# EAGLE design Qwiic Solid State Relay (EAGLE 9.6.0)
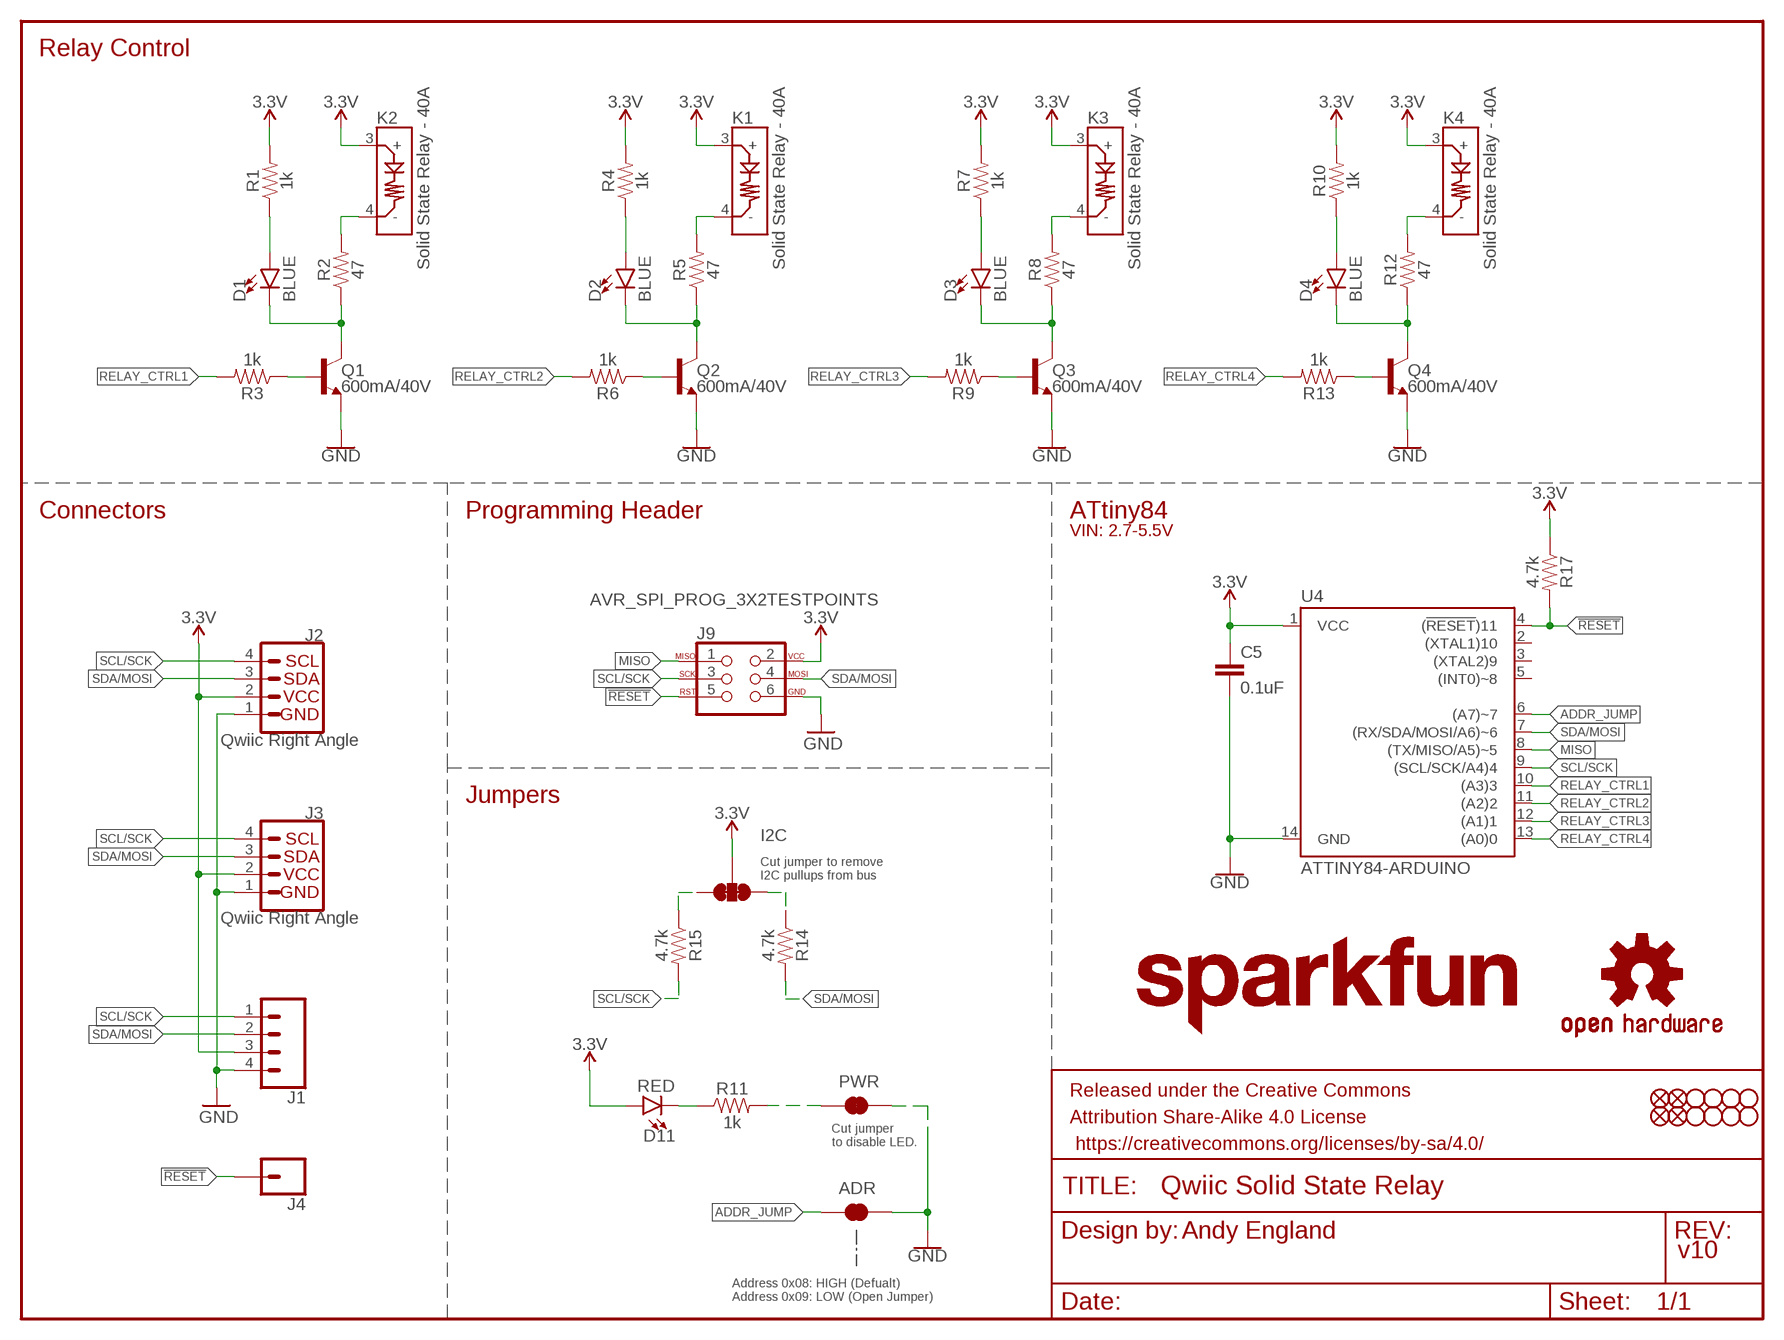
[diagram p0: schematic, sheet 1]

## Parts
ADR  JUMPER-SMT_2_NC_TRACE_SILK  [SMT-JUMPER_2_NC_TRACE_SILK]
C5  0.1uF  0.1UF-0603-25V-(+80/-20%)  [0603]
D1  BLUE  LED-BLUE0603  [LED-0603]
D2  BLUE  LED-BLUE0603  [LED-0603]
D3  BLUE  LED-BLUE0603  [LED-0603]
D4  BLUE  LED-BLUE0603  [LED-0603]
D11  RED  LED-RED0603  [LED-0603]
FD1  FIDUCIAL1X2  [FIDUCIAL-1X2]
FD2  FIDUCIAL1X2  [FIDUCIAL-1X2]
FD3  FIDUCIAL1X2  [FIDUCIAL-1X2]
FD4  FIDUCIAL1X2  [FIDUCIAL-1X2]
FRAME1  FRAME-LETTER  [CREATIVE_COMMONS]
I2C  JUMPER-SMT_3_2-NC_TRACE_SILK  [SMT-JUMPER_3_2-NC_TRACE_SILK]
J1  CONN_041X04_NO_SILK  [1X04_NO_SILK]
J2  Qwiic Right Angle  I2C_STANDARDQWIIC  [JST04_1MM_RA]
J3  Qwiic Right Angle  I2C_STANDARDQWIIC  [JST04_1MM_RA]
J4  CONN_01PTH_NO_SILK_YES_STOP  [1X01_NO_SILK]
J9  AVR_SPI_PROG_3X2TESTPOINTS  [2X3_TEST_POINTS]
JP1  STAND-OFF  [STAND-OFF]
JP2  STAND-OFF  [STAND-OFF]
JP3  STAND-OFF  [STAND-OFF]
JP4  STAND-OFF  [STAND-OFF]
JP5  STAND-OFF  [STAND-OFF]
JP6  STAND-OFF  [STAND-OFF]
JP7  STAND-OFF  [STAND-OFF]
JP8  STAND-OFF  [STAND-OFF]
K1  Solid State Relay - 40A  SOLID_STATE_RELAY_SSR-40DA-H  [SSR-40DA-H]
K2  Solid State Relay - 40A  SOLID_STATE_RELAY_SSR-40DA-H  [SSR-40DA-H]
K3  Solid State Relay - 40A  SOLID_STATE_RELAY_SSR-40DA-H  [SSR-40DA-H]
K4  Solid State Relay - 40A  SOLID_STATE_RELAY_SSR-40DA-H  [SSR-40DA-H]
LOGO1  SFE_LOGO_NAME1_INCH  [SFE_LOGO_NAME_1]
LOGO2  OSHW-LOGOS  [OSHW-LOGO-S]
PWR  JUMPER-SMT_2_NC_TRACE_SILK  [SMT-JUMPER_2_NC_TRACE_SILK]
Q1  600mA/40V  TRANS_NPN-MMBT2222AL  [SOT23-3]
Q2  600mA/40V  TRANS_NPN-MMBT2222AL  [SOT23-3]
Q3  600mA/40V  TRANS_NPN-MMBT2222AL  [SOT23-3]
Q4  600mA/40V  TRANS_NPN-MMBT2222AL  [SOT23-3]
R1  1k  1KOHM-0603-1/10W-1%  [0603]
R2  47  47OHM-0603-1/10W-1%  [0603]
R3  1k  1KOHM-0603-1/10W-1%  [0603]
R4  1k  1KOHM-0603-1/10W-1%  [0603]
R5  47  47OHM-0603-1/10W-1%  [0603]
R6  1k  1KOHM-0603-1/10W-1%  [0603]
R7  1k  1KOHM-0603-1/10W-1%  [0603]
R8  47  47OHM-0603-1/10W-1%  [0603]
R9  1k  1KOHM-0603-1/10W-1%  [0603]
R10  1k  1KOHM-0603-1/10W-1%  [0603]
R11  1k  1KOHM-0603-1/10W-1%  [0603]
R12  47  47OHM-0603-1/10W-1%  [0603]
R13  1k  1KOHM-0603-1/10W-1%  [0603]
R14  4.7k  4.7KOHM-0603-1/10W-1%  [0603]
R15  4.7k  4.7KOHM-0603-1/10W-1%  [0603]
R17  4.7k  4.7KOHM-0603-1/10W-1%  [0603]
U4  ATTINY84-ARDUINO  [SO14]

## Nets
3.3V: C5.1 D11.A I2C.2 J1.3 J2.2 J3.2 J9.2 K1.3(+) K2.3(+) K3.3(+) K4.3(+) R1.2 R4.2 R7.2 R10.2 R17.1 U4.1(VCC)
!RESET: J4.1 J9.5 R17.2 U4.4((!RESET!)11)
ADDR_JUMP: ADR.1 U4.6((A7)~7)
GND: ADR.2 C5.2 J1.4 J2.1 J3.1 J9.6 PWR.1 Q1.2(E) Q2.2(E) Q3.2(E) Q4.2(E) U4.14(GND)
MISO: J9.1 U4.8((TX/MISO/A5)~5)
N$1: D2.C Q2.3(C) R5.1
N$2: D1.C Q1.3(C) R2.1
N$3: K1.4(-) R5.2
N$4: D2.A R4.1
N$5: D3.C Q3.3(C) R8.1
N$6: K3.4(-) R8.2
N$7: D1.A R1.1
N$8: D3.A R7.1
N$9: D4.C Q4.3(C) R12.1
N$10: K2.4(-) R2.2
N$11: K4.4(-) R12.2
N$12: D4.A R10.1
N$13: D11.C R11.1
N$14: PWR.2 R11.2
N$15: I2C.3 R15.1
N$16: I2C.1 R14.1
OPTO_1: Q1.1(B) R3.1
OPTO_2: Q2.1(B) R6.1
OPTO_3: Q3.1(B) R9.1
OPTO_4: Q4.1(B) R13.1
RELAY_CTRL1: R3.2 U4.10((A3)3)
RELAY_CTRL2: R6.2 U4.11((A2)2)
RELAY_CTRL3: R9.2 U4.12((A1)1)
RELAY_CTRL4: R13.2 U4.13((A0)0)
SCL/SCK: J1.1 J2.4 J3.4 J9.3 R15.2 U4.9((SCL/SCK/A4)4)
SDA/MOSI: J1.2 J2.3 J3.3 J9.4 R14.2 U4.7((RX/SDA/MOSI/A6)~6)
Unconnected: U4.2((XTAL1)10) U4.3((XTAL2)9) U4.5((INT0)~8)

## Notes on the sheet
- Relay Control
- Connectors | Programming Header | ATtiny84
- VIN: 2.7-5.5V
- Jumpers
- Cut jumper to remove 
  I2C pullups from bus
- Cut jumper 
  to disable LED.
- Andy England
- v10
- Address 0x08: HIGH (Defualt)
  Address 0x09: LOW (Open Jumper)

## Library data of the parts
ADR PWR = SparkFun-Jumpers:JUMPER-SMT_2_NC_TRACE: Normally closed trace jumper This jumper has a trace between two pads so it's normally closed (NC). Use a razor knife to open the connection. For best results follow the IPC guidelines for cutting traces: Cutout at least 0.063 mm (0.005 in). Remove all loose material to clean up the cut area. Seal the cut with an approved epoxy. Reapply solder to reclose the connection.
C5 = SparkFun-Capacitors:0.1UF: 0.1µF ceramic capacitors A capacitor is a passive two-terminal electrical component used to store electrical energy temporarily in an electric field.; PROD_ID: CAP-00810
D1-D4 = SparkFun-LED:LED-BLUE: Blue SMD LED Used in manufacturing of various products at SparkFun Packages: 0603 - SMD 0603 package [Product Link] <http://www.digikey.com/product-detail/en/SMLE12BC7TT86/511-1589-2-ND/1641808> 1206 - SMD1206 package [Product Link] <http://www.digikey.com/product-detail/en/lite-on-inc/LTST-C150TBKT/160-1643-1-ND/573584> SparkFun Products: ESP8266 Thing-Dev Board <https://www.sparkfun.com/products/13711> RedBoard <https://www.sparkfun.com/products/12757>; PROD_ID: DIO-08575
D11 = SparkFun-LED:LED-RED: Red SMD LED Used in manufacturing of most products at SparkFun Packages: 0603 - SMD 0603 package [Product Link] <http://docs.avagotech.com/docs/AV02-0551EN> 0603 SMART - SMD 0603 SMART package ( more efficient and expensive)[Product Link] <http://www.osram-os.com/Graphics/XPic2/00077099_0.pdf> 1206 - SMD1206 package [Product Link] <https://www.sparkfun.com/datasheets/DevTools/LilyPad/Q150OVS4.pdff> SparkFun Products: Pro Mini 328 -5V <https://www.sparkfun.com/products/821> RedBoard <https://www.sparkfun.com/products/12757> IOIO-OTG <https://www.sparkfun.com/products/13613>; PROD_ID: DIO-00819
FD1-FD4 = SparkFun-Aesthetics:FIDUCIAL: Fiducial Alignment Points Point-of-reference for pick-and-place machines and other optical instruments.
FRAME1 = SparkFun-Aesthetics:FRAME-LETTER: Schematic Frame - Letter Standard 8.5x11 US Letter frame
I2C = SparkFun-Jumpers:JUMPER-SMT_3_2-NC_TRACE: Normally closed trace jumper (2 of 2 connections) This jumper has a trace between all three pads so they are normally closed (NC). Use a razor knife to open the connection(s). For best results follow the IPC guidelines for cutting traces: Cutout at least 0.063 mm (0.005 in). Remove all loose material to clean up the cut area. Seal the cut with an approved epoxy. Reapply solder to reclose the connection(s).
J1 = SparkFun-Connectors:CONN_04: Multi connection point. Often used as Generic Header-pin footprint for 0.1 inch spaced/style header connections On any of the 0.1 inch spaced packages, you can populate with these: Break Away Headers - Straight <https://www.sparkfun.com/products/116> (PRT-00116) Break Away Male Headers - Right Angle <https://www.sparkfun.com/products/553> (PRT-00553) Female Headers <https://www.sparkfun.com/products/115> (PRT-00115) Break Away Headers - Machine Pin <https://www.sparkfun.com/products/117> (PRT-00117) Break Away Female Headers - Swiss Machine Pin <https://www.sparkfun.com/products/743> (PRT-00743) For SCREWTERMINALS and SPRING TERMINALS visit here: Screw Terimnals on SparkFun.com <https://www.sparkfun.com/search/results?term=Screw+Terminals> (5mm/3.5mm/2.54mm spacing) This device is also useful as a general connection point to wire up your design to another part of your project. Our various solder wires solder well into these plated through hole pads. Hook-Up Wire - Assortment (Stranded, 22 AWG) <https://www.sparkfun.com/products/11375> (PRT-11375) Hook-Up Wire - Assortment (Solid Core, 22 AWG) <https://www.sparkfun.com/products/11367> (PRT-11367) View the entire wire category on our website here <https://www.sparkfun.com/categories/141> Special notes: Molex polarized connector foot print use with SKU : PRT-08231 with associated crimp pins and housings. 1MM SMD Version SKU: PRT-10208; PROD_ID: CONN-09696
J2 J3 = SparkFun-Connectors:I2C_STANDARD: SparkFun I2C Standard Pinout Header SparkFun has standardized on a pinout for all I2C based sensor breakouts. This pinout allows I2C boards to be plugged directly into the headers on Arduino Uno compatible boards, and to be daisy chained easily. Example SparkFun Products: SparkFun Atmospheric Sensor Breakout - BME280 <https://www.sparkfun.com/products/13676> SparkFun Altitude/Pressure Sensor Breakout - MPL3115A2 <https://www.sparkfun.com/products/11084> SparkFun TOF Range Finder Sensor - VL6180 <https://www.sparkfun.com/products/12785>; PROD_ID: CONN-13694
J4 = SparkFun-Connectors:CONN_01: Single connection point. Often used as Generic Header-pin footprint for 0.1 inch spaced/style header connections On any of the 0.1 inch spaced packages, you can populate with these: Break Away Headers - Straight <https://www.sparkfun.com/products/116> (PRT-00116) Break Away Male Headers - Right Angle <https://www.sparkfun.com/products/553> (PRT-00553) Female Headers <https://www.sparkfun.com/products/115> (PRT-00115) Break Away Headers - Machine Pin <https://www.sparkfun.com/products/117> (PRT-00117) Break Away Female Headers - Swiss Machine Pin <https://www.sparkfun.com/products/743> (PRT-00743) This device is also useful as a general connection point to wire up your design to another part of your project. Our various solder wires solder well into these plated through hole pads. Hook-Up Wire - Assortment (Stranded, 22 AWG) <https://www.sparkfun.com/products/11375> (PRT-11375) Hook-Up Wire - Assortment (Solid Core, 22 AWG) <https://www.sparkfun.com/products/11367> (PRT-11367) View the entire wire category on our website here <https://www.sparkfun.com/categories/141> Special notes: SMTSO-256-ET is a "flush mount" nut for a 4-40 screw. We mostly use this on specialty testbeds; it is a nice way to connect hardware to your PCB at an adjustable hieght. Also note, the SNAP packages are for using a snappable style connector. We sell a baggie of snaps and they are also used on two LilyPad designs: Snap Assortment - 30 pack (male and female) <https://www.sparkfun.com/products/11347> (DEV-11347) LilyPad Arduino SimpleSnap <https://www.sparkfun.com/products/10941> (DEV-10941) LilyPad SimpleSnap Protoboard <https://www.sparkfun.com/products/10940> (DEV-10940)
J9 = SparkFun-Connectors:AVR_SPI_PROG_3X2: AVR ISP 6 Pin This is the reduced ISP connector for AVR programming. Common on Arduino. This footprint will take up less PCB space and can be used with a 10-pin to 6-pin adapter such as SKU: BOB-08508 **Special note about "TEST_POINT" package. The stop mask is on the top side, so if you want your programming test points to be on the bottom of your board, make sure to place this package on the bottom side of the board. This also ensure that the orientation to program from the bottom side will be correct. SparkFun Products: SparkFun ISP Pogo Adapter <https://www.sparkfun.com/products/11591> - NS Tiny AVR Programmer <https://www.sparkfun.com/products/11801> -PTH
JP1-JP8 = SparkFun-Hardware:STAND-OFF: Stand Off Drill holes for mechanically mounting via screws, standoffs, etc. Note: Use the keepout ring to avoid running the screw head into surrounding components. Variant Overviews STAND-OFF - Mechanical footprint for a #4 phillips button head screw. STAND-OFF-TIGHT - Mechanical footprint for a #4 phillips button head screw, Example SparkFun Products Screw - Phillips Head (1/4", 4-40, 10 pack) <https://www.sparkfun.com/products/10453> (PRT-10453) Screw - Phillips Head (1/2", 4-40, 10 pack) <https://www.sparkfun.com/products/10452> (PRT-10452) Screw - Phillips Head (3/4", 4-40, 10 pack) <https://www.sparkfun.com/products/10451> (PRT-10451) Screw - Phillips Head (1", 4-40, 10 pack) <https://www.sparkfun.com/products/10450> (PRT-10450)
K1-K4 = SparkFun-DiscreteSemi:SOLID_STATE_RELAY_SSR-40DA-H: Fotek SSR-40DA-H DC->AC Solid State Relay This particular SSR can switch current loads of up to 40A with a 3-32V DC input and a zero cross trigger control method. Each one of these relays is equipped with four screw terminals (for use with ring or fork connectors) and a plastic cover that slides over the top of the relay to protect the terminals.; PROD_ID: COMP-15116, CONN-08399, 2 x HW-15038
LOGO1 = SparkFun-Aesthetics:SFE_LOGO_NAME: SparkFun Font Logo This is the SparkFun name logo. The logo on the schematic will always be the same size; the package variant is the height of the flame part of the logo (or the height the flame would be, if it were drawn). Default layer for the logo on the board is tSilk.
LOGO2 = SparkFun-Aesthetics:OSHW-LOGO: Open-Source Hardware (OSHW) Logo This logo indicates the piece of hardware it is found on incorporates a OSHW license and/or adheres to the definition of open source hardware found here: http://freedomdefined.org/OSHW
Q1-Q4 = SparkFun-DiscreteSemi:TRANS_NPN: NPN transistor Current controlled devices typically used to amplify current or used as a switch. BC547 - COM-08928 <http://www.sparkfun.com/products/8928> (TO-92 45V 100mA) (1.Collector 2.Base 3.Emitter) 2N3904 - COM-00521 <http://www.sparkfun.com/products/521> (TO-92 40V 200mA) (1.Emitter 2.Base 3.Collector) P2N2222A - COM-12852 <http://www.sparkfun.com/products/12852> (TO-92 40V 600mA) (1.Collector 2.Base 3.Emitter); PROD_ID: TRANS-08049
R1 R3 R4 R6 R7 R9-R11 R13 = SparkFun-Resistors:1KOHM: 1kΩ resistor A resistor is a passive two-terminal electrical component that implements electrical resistance as a circuit element. Resistors act to reduce current flow, and, at the same time, act to lower voltage levels within circuits. - Wikipedia; PROD_ID: RES-07856
R2 R5 R8 R12 = SparkFun-Resistors:47OHM: 47Ω resistor A resistor is a passive two-terminal electrical component that implements electrical resistance as a circuit element. Resistors act to reduce current flow, and, at the same time, act to lower voltage levels within circuits. - Wikipedia; PROD_ID: RES-14282
R14 R15 R17 = SparkFun-Resistors:4.7KOHM: 4.7kΩ resistor A resistor is a passive two-terminal electrical component that implements electrical resistance as a circuit element. Resistors act to reduce current flow, and, at the same time, act to lower voltage levels within circuits. - Wikipedia; PROD_ID: RES-07857
U4 = SparkFun-IC-Microcontroller:ATTINY84-ARDUINO; PROD_ID: IC-14155

## Board
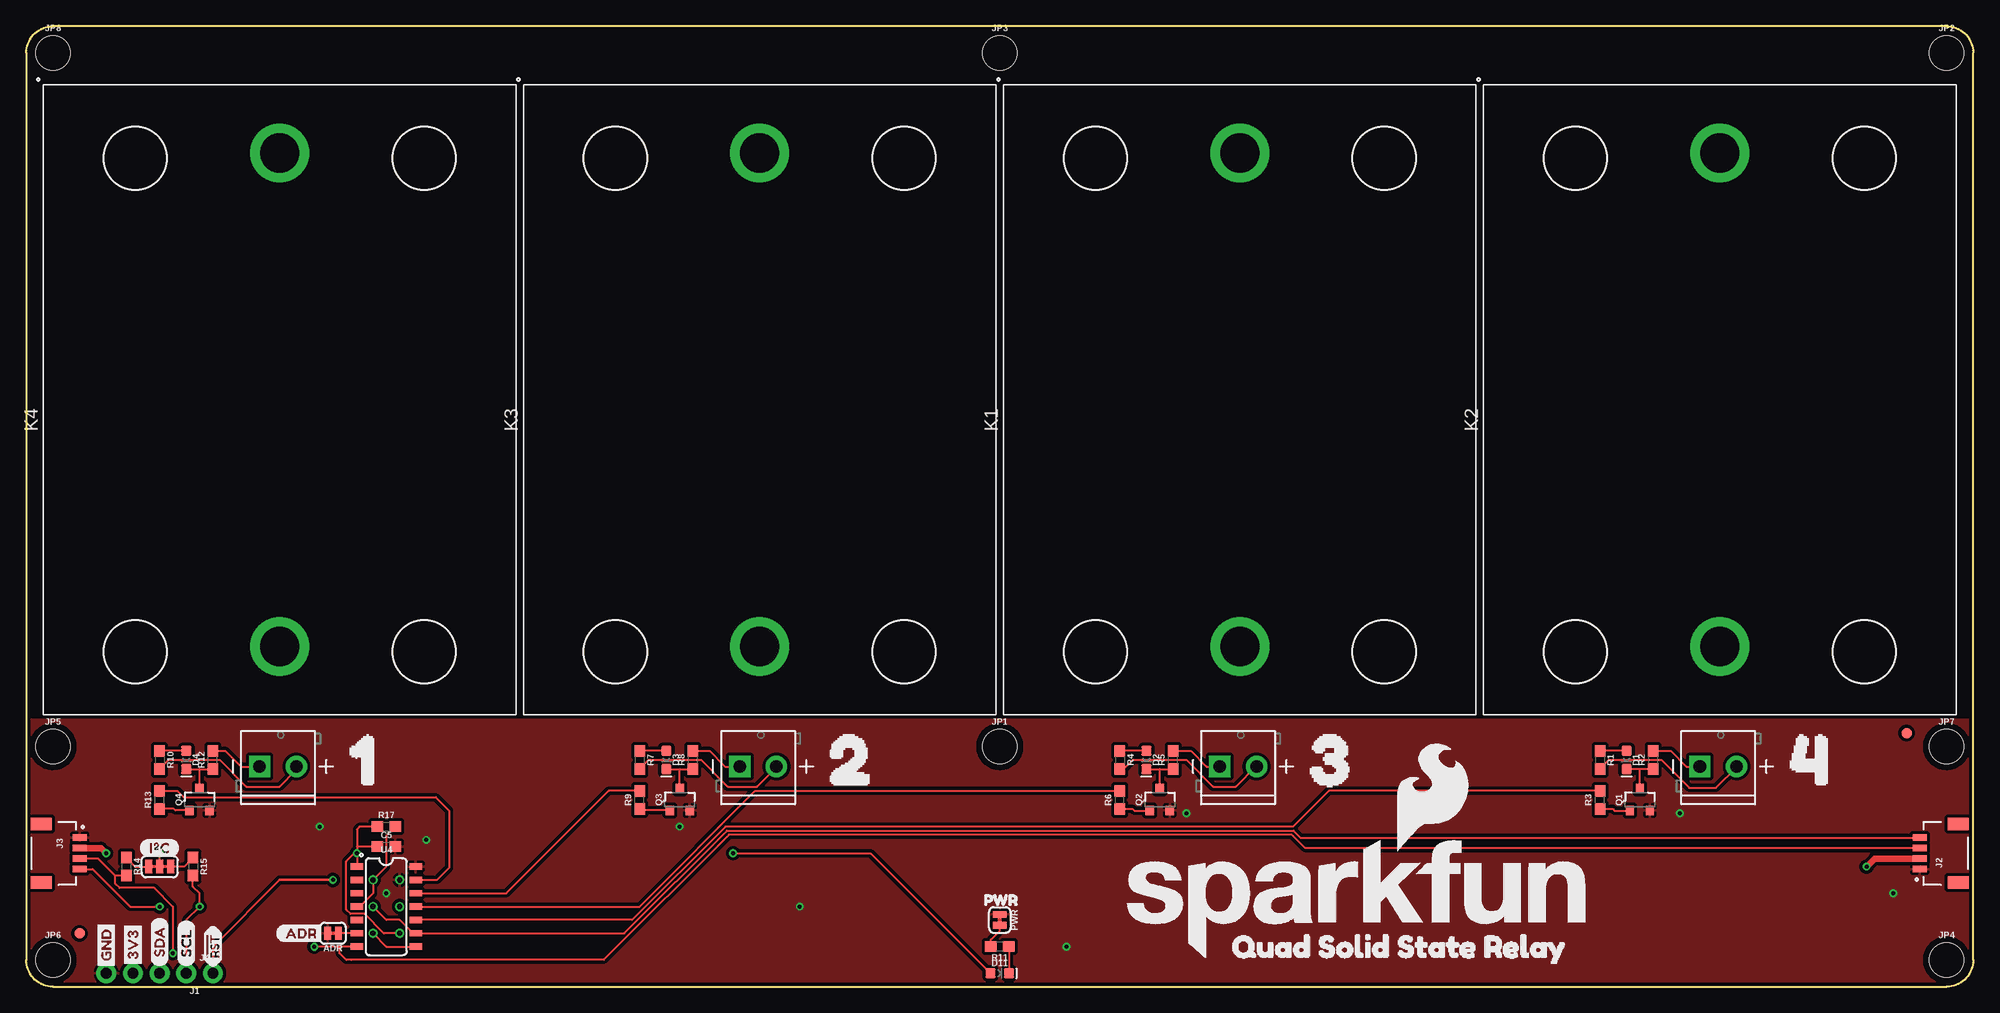
[diagram p1: board, top side]
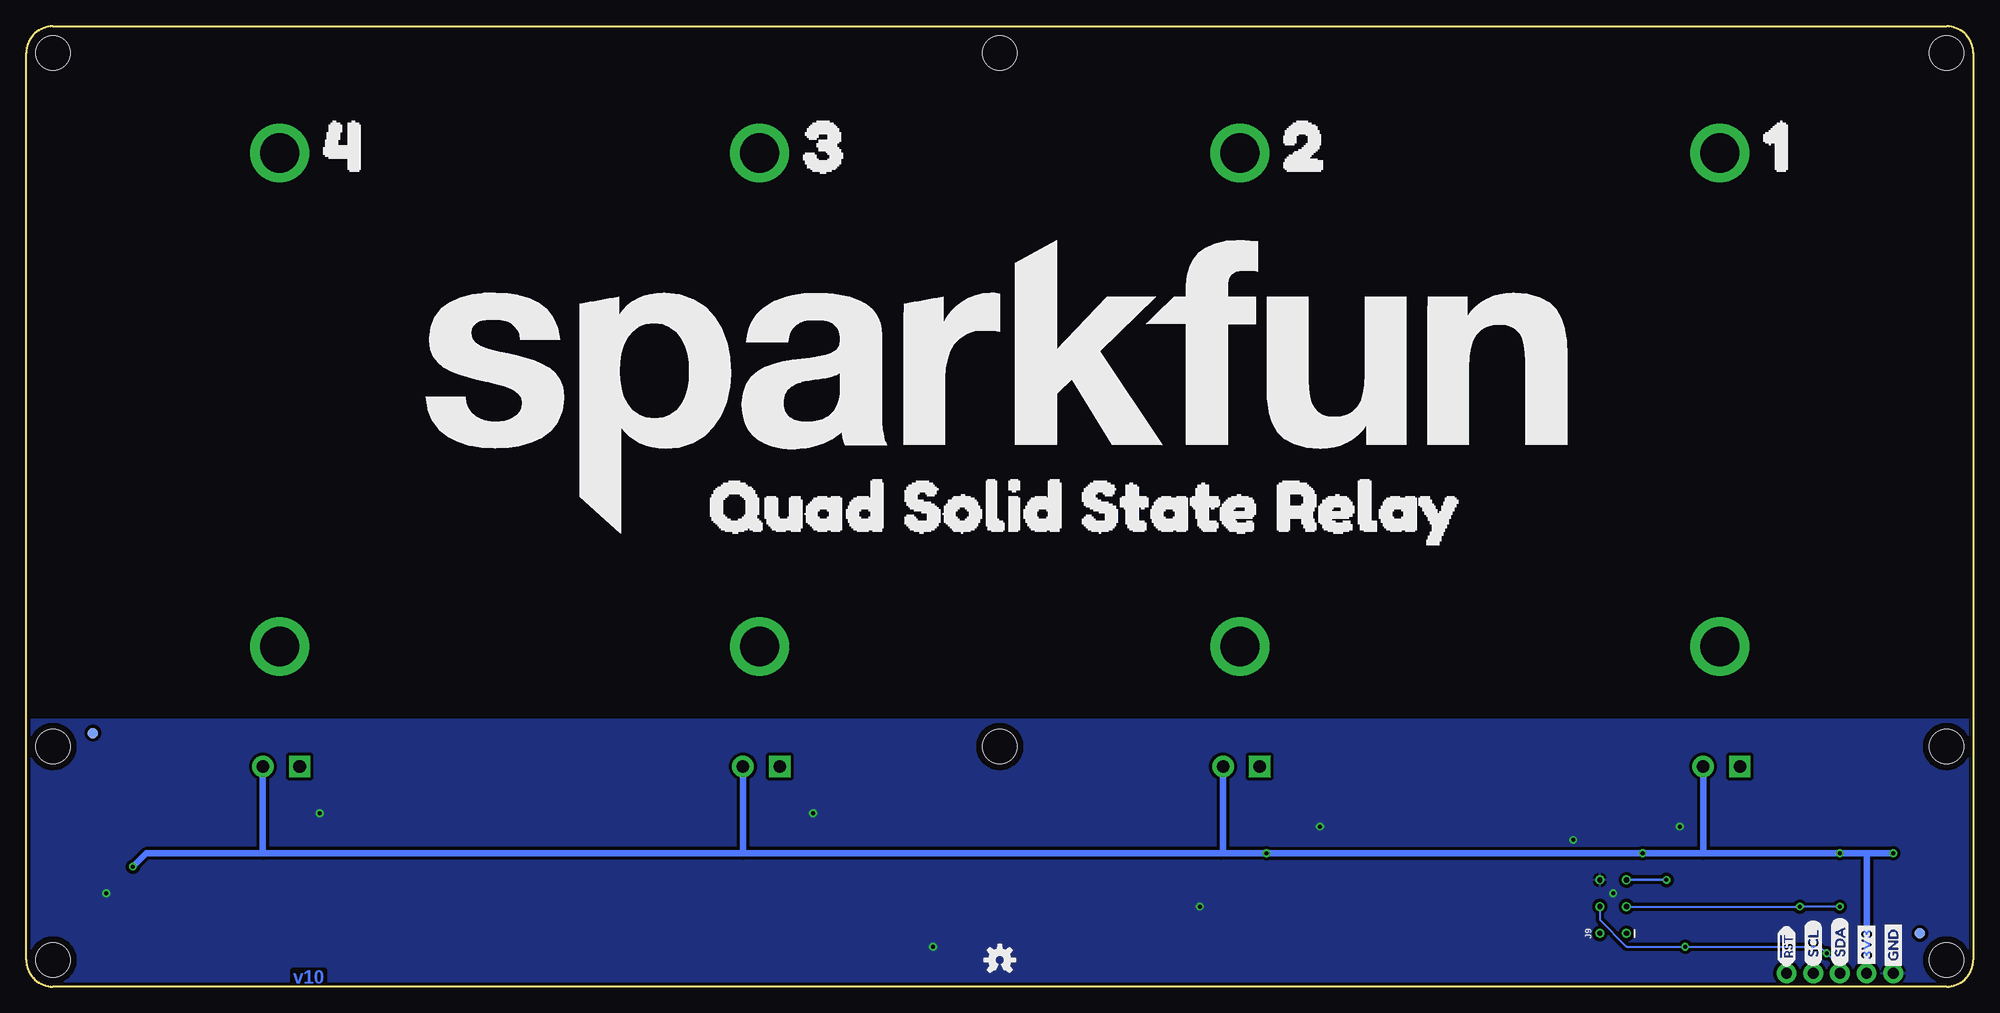
[diagram p2: board, bottom side, seen from below]

Size 185.42 x 91.44 mm. Coordinates in mm from the lower left corner, seen from the top.
Outline: 2.54,0 182.88,0 arc90 185.42,2.54 185.42,88.9 arc90 182.88,91.44 2.54,91.44 arc90 0,88.9 0,2.54 arc90 2.54,0
Copper layers (1*16): Top 0.035mm / dielectric 1.5mm / Bottom 0.035mm
Design rules "SparkFun-2-layer-TIGHT": minimum track width 7mil, minimum drill 15mil, track to track 7mil, track to pad 7mil, pad to pad 7mil, via to via 7mil, smd to smd 7mil, copper to edge 7mil, drill to drill 7mil, minimum pad ring 7mil, minimum via ring 7mil, stop-mask expansion 4mil, vias tented up to drill 25mil, thermal gap 10mil

### Footprints (pad centres in the part's own frame; a part is rotated, then mirrored left to right if it is on the bottom)
SMT-JUMPER_2_NC_TRACE_SILK = smd 0.66 x 1.27: 1 -0.521,0; 2 0.521,0
0603 = smd 1.1 x 1: 1 -0.85,0; 2 0.85,0
LED-0603 = smd 1 x 1: A -0.877,0; C 0.877,0
FIDUCIAL-1X2 = smd 1 x 1: 1 0,0
SMT-JUMPER_3_2-NC_TRACE_SILK = smd 0.66 x 1.27: 1 -1.041,0; 2 0,0; 3 1.041,0
1X04_NO_SILK = drill 1.016 pad 1.88: 1 0,0; 2 2.54,0; 3 5.08,0; 4 7.62,0
JST04_1MM_RA = smd 0.6 x 1.35: 1 -1.5,0; 2 -0.5,0; 3 0.5,0; 4 1.5,0 | smd 1.2 x 2: NC1 2.8,-3.675; NC2 -2.8,-3.675
1X01_NO_SILK = drill 1.016 pad 1.88: 1 0,0
2X3_TEST_POINTS = drill 0.508: 1 -2.54,-1.27; 2 -2.54,1.27; 3 0,-1.27; 4 0,1.27; 5 2.54,-1.27; 6 2.54,1.27
STAND-OFF = hole 3.302: 0,0
SSR-40DA-H = drill 1.2 pad 2.032: 3 -34.925,-1.595 | drill 1.2 pad 2.032 square: 4 -34.925,1.905 | drill 3.73 pad 5.6: H1 -23.5,0; H2 23.49,0
SOT23-3 = smd 0.8 x 0.9: 1 -0.95,-1; 2 0.95,-1; 3 0,1.1
SO14 = smd 0.6 x 1.2: 1 -3.81,-2.8; 2 -2.54,-2.8; 3 -1.27,-2.8; 4 0,-2.8; 5 1.27,-2.8; 6 2.54,-2.8; 7 3.81,-2.8; 8 3.81,2.8; 9 2.54,2.8; 10 1.27,2.8; 11 0,2.8; 12 -1.27,2.8; 13 -2.54,2.8; 14 -3.81,2.8

### Placement (x,y rotation side)
ADR  29.21,5.08 180 top
C5  34.29,13.34 0 top
D1  152.4,21.59 270 top
D2  106.68,21.59 270 top
D3  60.96,21.59 270 top
D4  15.24,21.59 270 top
D11  92.71,1.27 0 top
FD1  179.07,24.13 0 top
FD2  179.07,24.13 0 bottom
FD3  5.08,5.08 0 bottom
FD4  5.08,5.08 0 top
FRAME1  67.31,-19.05 0 top  (outside the outline)
I2C  12.7,11.43 0 top
J1  15.24,1.27 180 top
J2  180.34,12.7 90 top
J3  5.08,12.7 270 top
J4  17.78,1.27 0 top
J9  34.29,7.62 90 bottom
JP1  92.71,22.86 0 top
JP2  182.88,88.9 0 top
JP3  92.71,88.9 0 top
JP4  182.88,2.54 0 top
JP5  2.54,22.86 0 top
JP6  2.54,2.54 0 top
JP7  182.88,22.86 0 top
JP8  2.54,88.9 0 top
K1  115.57,55.88 90 top
K2  161.29,55.88 90 top
K3  69.85,55.88 90 top
K4  24.13,55.88 90 top
LOGO1  147.32,43.18 0 bottom
LOGO2  92.71,2.54 0 bottom
PWR  92.71,6.35 270 top
Q1  153.67,17.78 0 top
Q2  107.95,17.78 0 top
Q3  62.23,17.78 0 top
Q4  16.51,17.78 0 top
R1  149.86,21.59 270 top
R2  154.94,21.59 90 top
R3  149.86,17.78 90 top
R4  104.14,21.59 270 top
R5  109.22,21.59 90 top
R6  104.14,17.78 90 top
R7  58.42,21.59 270 top
R8  63.5,21.59 90 top
R9  58.42,17.78 90 top
R10  12.7,21.59 270 top
R11  92.71,3.81 180 top
R12  17.78,21.59 90 top
R13  12.7,17.78 90 top
R14  9.53,11.43 270 top
R15  15.88,11.43 270 top
R17  34.29,15.24 0 top
U4  34.29,7.62 270 top
U$1  [SFE_LOGO_NAME_FLAME_.4]  104.14,2.54 0 top
U$2  [QUAD_SOLID_STATE_RELAY0]  124.46,45.72 0 bottom
U$3  [QUAD_SOLID_STATE_RELAY0]  113.03,3.81 0 top
U$4  [QUAD_SOLID_STATE_RELAY0]  113.03,3.81 0 top
U$5  [11]  26.67,21.59 0 top
U$6  [22]  72.39,21.59 0 top
U$7  [33]  118.11,21.59 0 top
U$8  [44]  163.83,21.59 0 top
U$9  [11]  24.13,80.01 0 bottom
U$10  [22]  69.85,80.01 0 bottom
U$11  [33]  115.57,80.01 0 bottom
U$12  [44]  161.29,80.01 0 bottom
U$13  [GND_P]  7.62,1.52 90 top
U$14  [GND_P]  7.62,1.52 90 bottom
U$15  [I2C]  10.79,13.21 0 top
U$16  [3V3_P]  10.16,1.65 90 top
U$17  [3V3_P]  10.16,1.65 90 bottom
U$18  [SCL_IO]  15.24,1.91 90 top
U$19  [SCL_IO]  15.24,1.91 90 bottom
U$20  [SDA_IO]  12.7,1.91 90 top
U$21  [SDA_IO]  12.7,1.91 90 bottom
U$22  [PWR_TO]  90.3,8.26 0 top
U$23  [ADR3]  23.75,5.08 0 top
U$24  [!RST_I]  17.78,1.65 90 top
U$25  [!RST_I]  17.78,1.65 90 bottom

### Tracks (layer width: path | path; a pad name or v marks a point on that pad's centre or on a via)
3.3V  (via drill 0.38)
  Top 0.203: R7.2 59.27,21.59 64.26,21.59 66.8,19.05 69.6,19.05 71.44,20.9 K3.3 | R4.2 104.56,20.74 105.41,21.59 110.49,21.59 113.03,19.05 115.19,19.05 117.17,21.03 K1.3 | R1.2 150.71,21.59 155.7,21.59 158.37,18.92 160.91,18.92 162.88,20.9 K2.3 | R10.2 13.55,21.59 18.41,21.59 20.95,19.05 24.13,19.05 25.73,20.64 K4.3 | R17.1 31.75,15.24 31.49,14.98 31.49,13.34 | 31.49,13.34 v31.49,12.7 | v31.49,12.7 U4.1 | C5.1 31.49,13.34 | J9.2 34.05,5.08 32.21,6.93 30.89,6.93 30.48,7.33 30.48,11.94 31.24,12.7 v31.49,12.7 | D11.A 80.4,12.7 v67.31,12.7 | I2C.2 v12.7,12.7
  Top 0.61: J3.2 7.12,13.2 v7.62,12.7 | v175.26,11.43 176.03,12.2 J2.2
  Bottom 0.61: v7.62,12.7 10.16,12.7 | 10.16,12.7 v12.7,12.7 25.78,12.7 | 25.78,12.7 v31.49,12.7 v67.31,12.7 71.63,12.7 | 71.63,12.7 117.17,12.7 | 117.17,12.7 162.81,12.7 | 162.81,12.7 173.99,12.7 v175.26,11.43 | K1.3 117.17,12.7 | K2.3 162.88,12.77 162.81,12.7 | K3.3 71.44,12.88 71.63,12.7 | 10.16,12.7 J1.3 | K4.3 25.73,12.76 25.78,12.7
!RESET  (via drill 0.38)
  Top 0.203: R17.2 34.29,14.39 34.29,11.43 J9.5 33.02,8.89 31.75,7.62 U4.4
  Top 0.254: J4.1 17.78,3.81 24.13,10.16 v29.21,10.16
  Bottom 0.254: v29.21,10.16 J9.5
ADDR_JUMP
  Top 0.203: U4.6 ADR.1
GND  (via drill 0.38)
  other vias: 27.94,15.24 38.1,13.97 34.29,8.89 62.23,15.24 110.49,16.51 99.06,3.81 73.66,7.62 157.48,16.51 177.8,8.89
  pour Top (isolate 0.305): 0,0 185.42,0 185.42,25.4 0,25.4
  pour Bottom (isolate 0.305): 185.42,0 0,0 0,25.4 185.42,25.4
MISO
  Top 0.203: J9.1 34.29,3.81 U4.8
N$1
  Top 0.203: D2.C 107.95,20.71 | 107.95,20.71 109.19,20.71 R5.1 | Q2.3 107.95,20.71
N$2
  Top 0.203: R2.1 154.91,20.71 153.67,20.71 | 153.67,20.71 D1.C | Q1.3 153.67,20.71
N$3
  Top 0.203: R5.2 110.91,22.44 112.39,20.95 K1.4
N$4
  Top 0.203: D2.A 104.17,22.47 R4.1
N$5
  Top 0.203: D3.C 62.23,20.71 | 62.23,20.71 63.47,20.71 R8.1 | Q3.3 62.23,20.71
N$6
  Top 0.203: R8.2 65.06,22.44 66.55,20.95 K3.4
N$7
  Top 0.203: D1.A 149.89,22.47 R1.1
N$8
  Top 0.203: D3.A 58.45,22.47 R7.1
N$9
  Top 0.203: D4.C 16.51,20.71 | 16.51,20.71 17.75,20.71 R12.1 | Q4.3 16.51,20.71
N$10
  Top 0.203: R2.2 156.63,22.44 158.12,20.95 K2.4
N$11
  Top 0.203: R12.2 18.96,22.44 20.45,20.95 K4.4
N$12
  Top 0.203: D4.A 12.73,22.47 R10.1
N$13
  Top 0.203: R11.1 93.59,3.78 D11.C
N$14
  Top 0.203: R11.2 91.86,4.48 92.71,5.33 PWR.2
N$15
  Top 0.203: R15.1 15.03,11.43 I2C.3
N$16
  Top 0.203: R14.1 10.38,11.43 I2C.1
OPTO_1
  Top 0.203: R3.1 151.09,16.93 151.26,16.76 152.7,16.76 Q1.1
OPTO_2
  Top 0.203: R6.1 105.37,16.93 105.54,16.76 106.98,16.76 Q2.1
OPTO_3
  Top 0.203: Q3.1 58.57,16.78 R9.1
OPTO_4
  Top 0.203: Q4.1 14.21,16.78 14.06,16.93 R13.1
RELAY_CTRL1
  Top 0.203: R3.2 124.04,18.63 120.65,15.24 66.58,15.24 57.69,6.35 U4.10
RELAY_CTRL2
  Top 0.203: U4.11 58.42,7.62 69.43,18.63 R6.2
RELAY_CTRL3
  Top 0.203: R9.2 55.46,18.63 45.72,8.89 U4.12
RELAY_CTRL4
  Top 0.203: R13.2 14.39,18.63 14.99,18.03 38.99,18.03 40.27,16.76 40.27,11.3 39.12,10.16 U4.13
SCL/SCK  (via drill 0.38)
  Top 0.203: J9.3 34.29,6.35 35.56,6.35 36.83,5.08 U4.9 56.96,5.08 66.74,14.86 120.68,14.86 121.34,14.2 J2.4 | J1.1 15.24,6.35 v16.51,7.62 16.51,8.89 15.88,9.53 R15.2 | J3.4 6.33,11.2 9.91,7.62 v12.7,7.62
  Bottom 0.203: J9.3 v16.51,7.62 v12.7,7.62
SDA/MOSI  (via drill 0.38)
  Top 0.178: 30.99,2.54 30.48,2.54 29.84,3.17 29.84,3.81
  Top 0.203: U4.7 29.84,3.81 v27.43,3.81 | v13.97,3.17 13.97,7.62 12.19,9.4 8.89,9.4 8.47,9.82 8.47,10.58 | J2.3 121.8,13.2 120.52,14.48 66.93,14.48 54.99,2.54 30.99,2.54 | R14.2 8.47,10.58 | J3.3 6.85,12.2 8.47,10.58
  Bottom 0.203: J1.2 12.7,1.91 v13.97,3.17 14.61,3.81 v27.43,3.81 33.02,3.81 35.56,6.35 J9.4

### Text on the board
Bottom: v10
tDocu: Andy England